# EAGLE schematic 101_led_yellow (EAGLE 7.4.0)
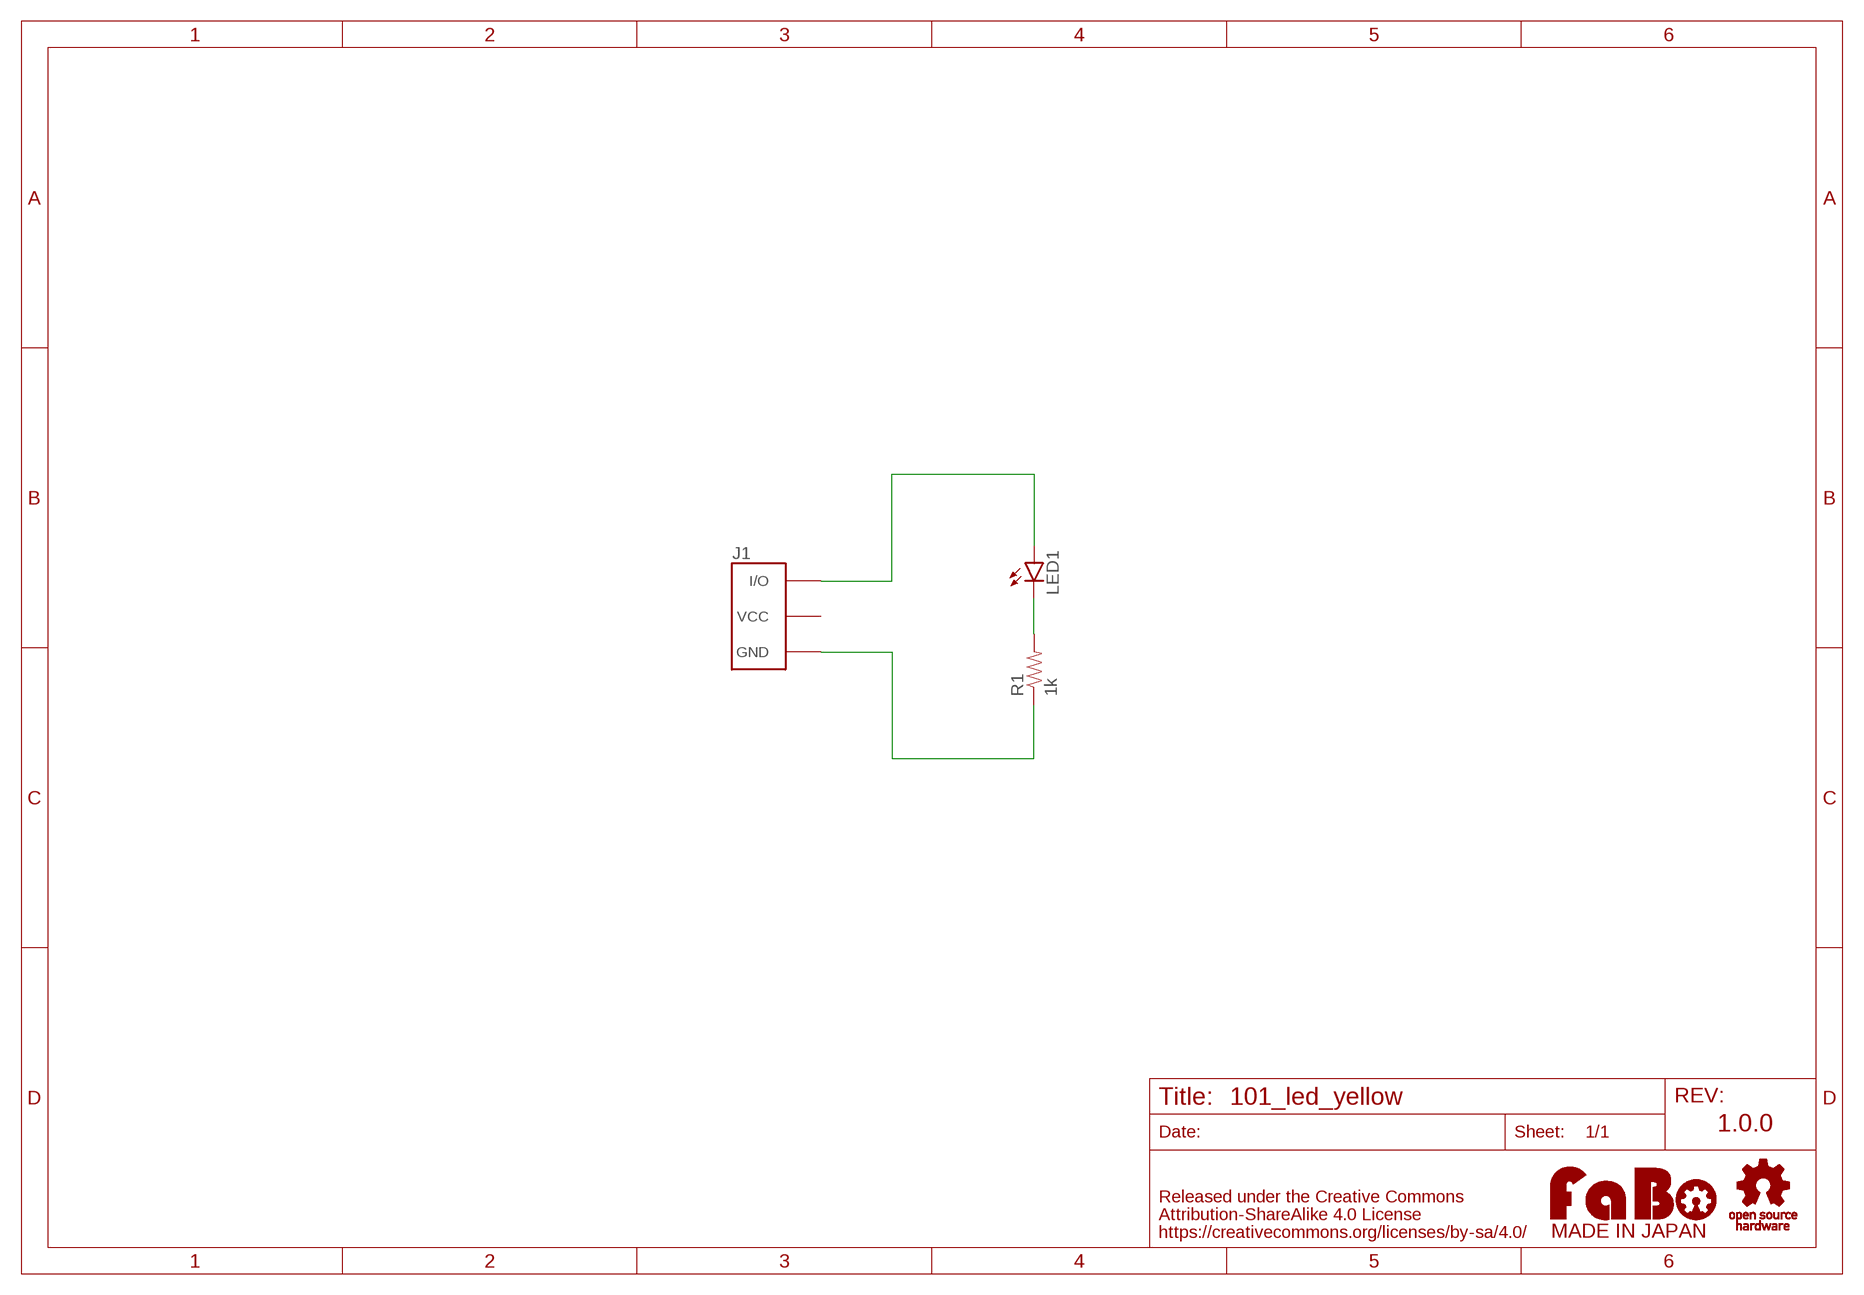
[diagram p0: schematic, sheet 1]

## Parts
J1  FABO_BRICK_3PIN  [FABO_BRICK_3PIN]
LED1  LED-5MM  [LED-5MM]
R1  1k  RES-PTH-REGULAR  [RES-AXL-REGULAR]
U$1  LOGO_FABO-M  [LOGO_FABO_M]
U$4  LOGO_OSHW_T-M  [LOGO_OSHW_T_M]

## Nets
GND: J1.GND R1.P$1
N$1: J1.IN/OUT(I/O) LED1.A
N$3: LED1.K(C) R1.P$2
Unconnected: J1.VCC

## Notes on the sheet
- 1.0.0

## Library data of the parts
J1 = FaBo-Template:FABO_BRICK_3PIN: FaBo Brick 3pin
LED1 = FaBo-etc:LED: LED
R1 = FaBo-etc:RES
U$1 = FaBo-etc:LOGO_FABO
U$4 = gclue:LOGO_OSHW_T